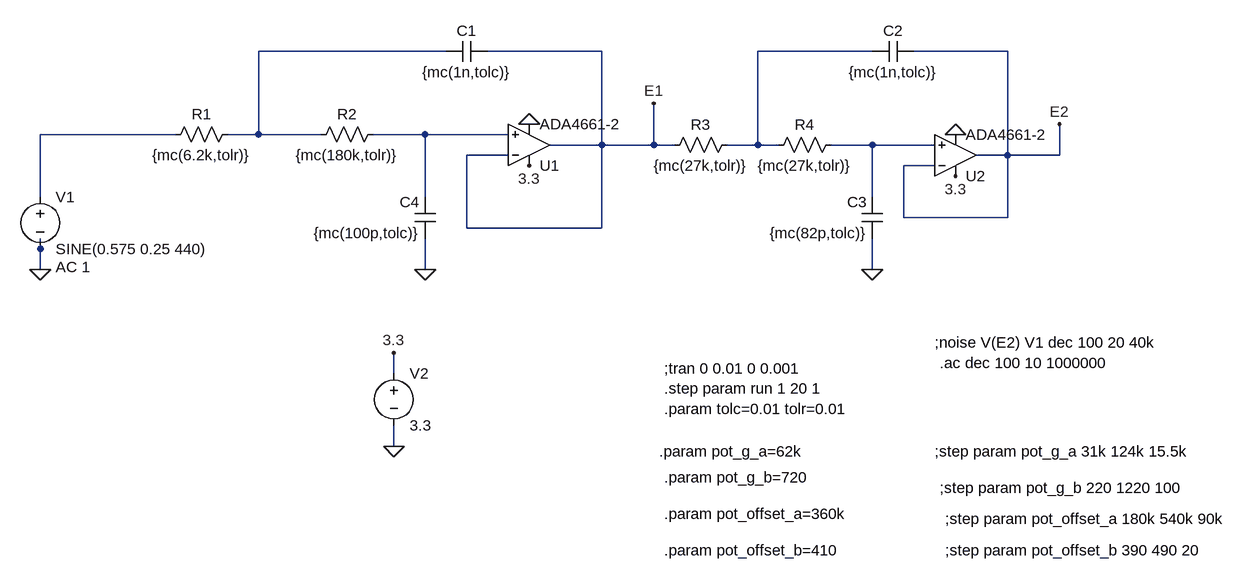
[diagram p0: schematic Montecarlo.asc]
Montecarlo.asc, the LTspice schematic file:
Version 4
SHEET 1 880 1440
WIRE -1424 656 -1712 656
WIRE -1184 656 -1360 656
WIRE -768 656 -944 656
WIRE -560 656 -704 656
WIRE -1840 784 -2048 784
WIRE -1712 784 -1712 656
WIRE -1712 784 -1760 784
WIRE -1616 784 -1712 784
WIRE -1456 784 -1536 784
WIRE -1328 784 -1456 784
WIRE -1184 800 -1184 656
WIRE -1184 800 -1264 800
WIRE -1104 800 -1104 736
WIRE -1104 800 -1184 800
WIRE -1072 800 -1104 800
WIRE -944 800 -944 656
WIRE -944 800 -992 800
WIRE -912 800 -944 800
WIRE -768 800 -832 800
WIRE -672 800 -768 800
WIRE -1328 816 -1392 816
WIRE -560 816 -560 656
WIRE -560 816 -608 816
WIRE -480 816 -480 768
WIRE -480 816 -560 816
WIRE -672 832 -720 832
WIRE -2048 880 -2048 784
WIRE -1456 880 -1456 784
WIRE -768 880 -768 800
WIRE -720 912 -720 832
WIRE -560 912 -560 816
WIRE -560 912 -720 912
WIRE -1392 928 -1392 816
WIRE -1184 928 -1184 800
WIRE -1184 928 -1392 928
WIRE -2048 960 -2048 944
WIRE -2048 992 -2048 960
WIRE -1456 992 -1456 944
WIRE -768 992 -768 944
WIRE -1504 1152 -1504 1120
WIRE -1504 1264 -1504 1232
FLAG -2048 992 0
FLAG -640 784 0
FLAG -1504 1264 0
FLAG -1504 1120 3.3
FLAG -640 848 3.3
FLAG -1104 736 E1
FLAG -1456 992 0
FLAG -768 992 0
FLAG -1296 832 3.3
FLAG -1296 768 0
FLAG -480 768 E2
SYMBOL voltage -2048 864 R0
WINDOW 123 24 124 Left 2
WINDOW 39 0 0 Left 0
SYMATTR Value2 AC 1
SYMATTR InstName V1
SYMATTR Value SINE(0.575 0.25 440)
SYMBOL Opamps\\ADA4661-2 -1296 864 M180
SYMATTR InstName U1
SYMBOL Opamps\\ADA4661-2 -640 880 M180
SYMATTR InstName U2
SYMBOL res -1744 768 R90
WINDOW 0 0 56 VBottom 2
WINDOW 3 32 56 VTop 2
SYMATTR InstName R1
SYMATTR Value {mc(6.2k,tolr)}
SYMATTR SpiceLine tol=1
SYMBOL res -1520 768 R90
WINDOW 0 0 56 VBottom 2
WINDOW 3 32 56 VTop 2
SYMATTR InstName R2
SYMATTR Value {mc(180k,tolr)}
SYMATTR SpiceLine tol=1
SYMBOL res -976 784 R90
WINDOW 0 0 56 VBottom 2
WINDOW 3 32 56 VTop 2
SYMATTR InstName R3
SYMATTR Value {mc(27k,tolr)}
SYMATTR SpiceLine tol=1
SYMBOL res -816 784 R90
WINDOW 0 0 56 VBottom 2
WINDOW 3 32 56 VTop 2
SYMATTR InstName R4
SYMATTR Value {mc(27k,tolr)}
SYMATTR SpiceLine tol=1
SYMBOL cap -1360 640 R90
WINDOW 0 0 32 VBottom 2
WINDOW 3 32 32 VTop 2
SYMATTR InstName C1
SYMATTR Value {mc(1n,tolc)}
SYMBOL cap -704 640 R90
WINDOW 0 0 32 VBottom 2
WINDOW 3 32 32 VTop 2
SYMATTR InstName C2
SYMATTR Value {mc(1n,tolc)}
SYMBOL cap -752 944 R180
WINDOW 0 24 56 Left 2
WINDOW 3 24 8 Left 2
SYMATTR InstName C3
SYMATTR Value {mc(82p,tolc)}
SYMBOL cap -1440 944 R180
WINDOW 0 24 56 Left 2
WINDOW 3 24 8 Left 2
SYMATTR InstName C4
SYMATTR Value {mc(100p,tolc)}
SYMBOL voltage -1504 1136 R0
WINDOW 123 0 0 Left 0
WINDOW 39 0 0 Left 0
SYMATTR InstName V2
SYMATTR Value 3.3
TEXT -1088 1144 Left 2 !;tran 0 0.01 0 0.001\n.step param run 1 20 1\n.param tolc=0.01 tolr=0.01
TEXT -672 1104 Left 2 !;noise V(E2) V1 dec 100 20 40k
TEXT -664 1136 Left 2 !.ac dec 100 10 1000000
TEXT -1096 1272 Left 2 !.param pot_g_a=62k
TEXT -1088 1368 Left 2 !.param pot_offset_a=360k
TEXT -664 1328 Left 2 !;step param pot_g_b 220 1220 100
TEXT -672 1272 Left 2 !;step param pot_g_a 31k 124k 15.5k
TEXT -1088 1312 Left 2 !.param pot_g_b=720
TEXT -1088 1424 Left 2 !.param pot_offset_b=410
TEXT -656 1424 Left 2 !;step param pot_offset_b 390 490 20
TEXT -656 1376 Left 2 !;step param pot_offset_a 180k 540k 90k

The netlist it stands for:
* Montecarlo.asc
V1 N003 0 SINE(0.575 0.25 440) AC 1
XU1 N004 E1 3.3 0 E1 ADA4661-2  ; pins In+ In- V+ V- OUT
XU2 N005 E2 3.3 0 E2 ADA4661-2  ; pins In+ In- V+ V- OUT
R1 N001 N003 {mc(6.2k,tolr)} tol=1
R2 N004 N001 {mc(180k,tolr)} tol=1
R3 N002 E1 {mc(27k,tolr)} tol=1
R4 N005 N002 {mc(27k,tolr)} tol=1
C1 E1 N001 {mc(1n,tolc)}
C2 E2 N002 {mc(1n,tolc)}
C3 0 N005 {mc(82p,tolc)}
C4 0 N004 {mc(100p,tolc)}
V2 3.3 0 3.3
;tran 0 0.01 0 0.001
.step param run 1 20 1
.param tolc=0.01 tolr=0.01
;noise V(E2) V1 dec 100 20 40k
.ac dec 100 10 1000000
.param pot_g_a=62k
.param pot_offset_a=360k
;step param pot_g_b 220 1220 100
;step param pot_g_a 31k 124k 15.5k
.param pot_g_b=720
.param pot_offset_b=410
;step param pot_offset_b 390 490 20
;step param pot_offset_a 180k 540k 90k
.lib ADI1.lib
.backanno
.end